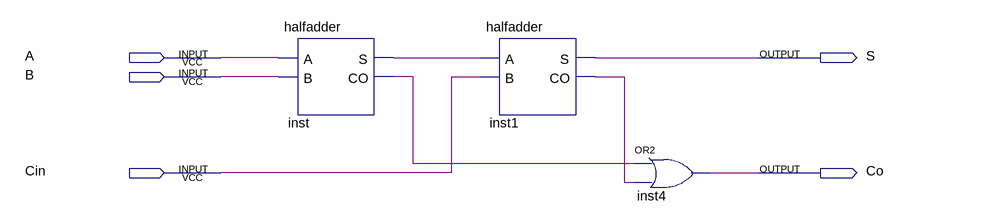
[diagram p0: schematic sheet]
// Quartus schematic fulladder.bdf as structural Verilog: 3 symbols, 5 pins
module fulladder (
  input  A,
  input  B,
  input  Cin,
  output S,
  output Co
);

  wire inst1_co, inst_co, inst_s;

  halfadder inst (.A(A), .B(B), .S(inst_s), .CO(inst_co));
  halfadder inst1 (.A(inst_s), .B(Cin), .S(S), .CO(inst1_co));
  or inst4 (Co, inst_co, inst1_co);
endmodule
